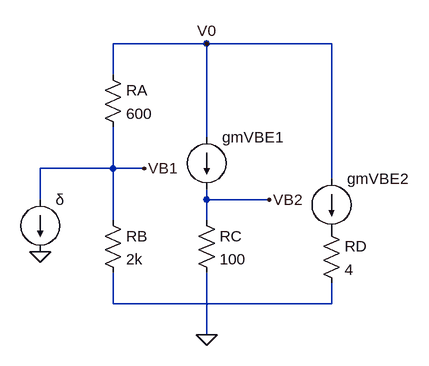
[diagram p0: schematic Draft1.asc]
Draft1.asc, the LTspice schematic file:
Version 4
SHEET 1 880 680
WIRE 464 -224 320 -224
WIRE 656 -224 464 -224
WIRE 320 -176 320 -224
WIRE 464 -80 464 -224
WIRE 320 -32 320 -96
WIRE 320 -32 208 -32
WIRE 368 -32 320 -32
WIRE 656 -16 656 -224
WIRE 208 16 208 -32
WIRE 464 16 464 0
WIRE 560 16 464 16
WIRE 320 48 320 -32
WIRE 464 48 464 16
WIRE 320 176 320 128
WIRE 656 176 656 144
WIRE 656 176 320 176
WIRE 464 224 464 128
FLAG 208 96 0
FLAG 464 224 0
FLAG 368 -32 VB1
FLAG 464 -224 V0
FLAG 560 16 VB2
SYMBOL current 208 16 R0
SYMATTR InstName δ
SYMATTR Value ""
SYMBOL res 304 32 R0
SYMATTR InstName RB
SYMATTR Value 2k
SYMBOL res 448 32 R0
SYMATTR InstName RC
SYMATTR Value 100
SYMBOL res 640 48 R0
SYMATTR InstName RD
SYMATTR Value 4
SYMBOL res 304 -192 R0
SYMATTR InstName RA
SYMATTR Value 600
SYMBOL current 464 -80 R0
SYMATTR InstName gmVBE1
SYMATTR Value ""
SYMBOL current 656 -16 R0
SYMATTR InstName gmVBE2
SYMATTR Value ""

The netlist it stands for:
* Draft1.asc
I§δ VB1 0
RB VB1 N001 2k
RC VB2 0 100
RD P001 N001 4
RA V0 VB1 600
I§gmVBE1 V0 VB2
I§gmVBE2 V0 P001
.backanno
.end